# Altium project iF11M.PrjPcb
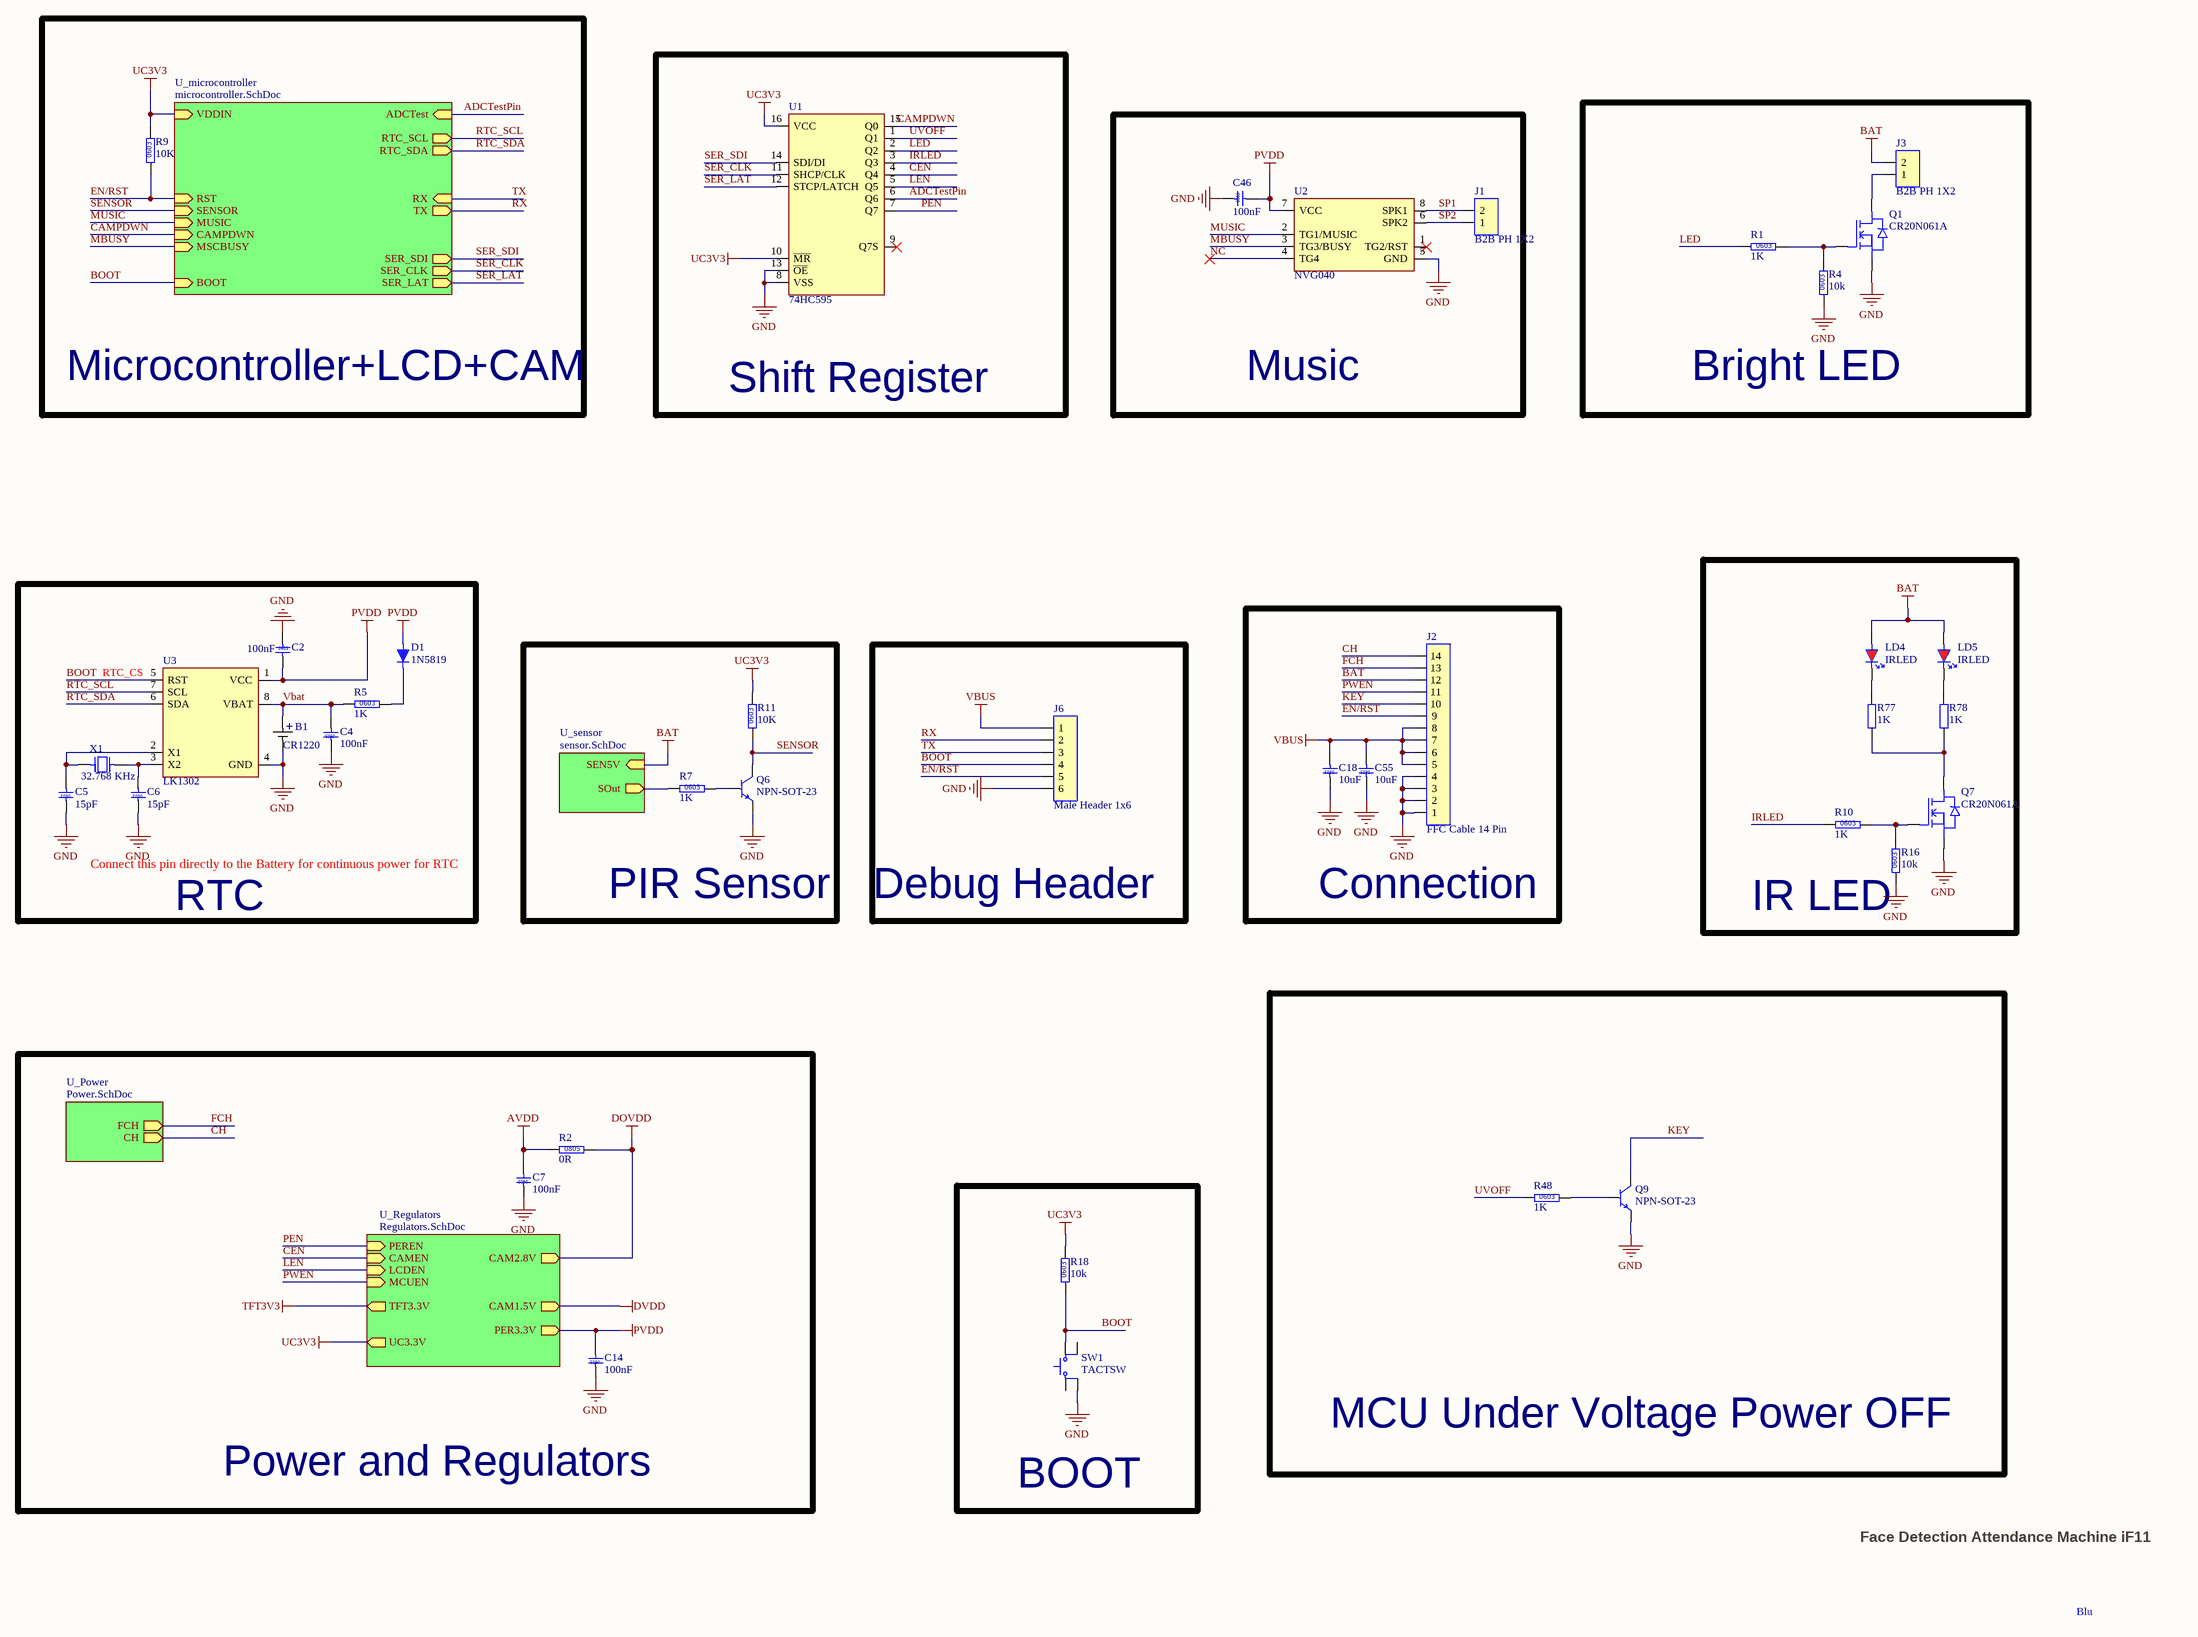
[diagram p0: iF11M.SchDoc]
6 sheets, 148 parts. Net scope: hierarchical (ports join the sheet entries above them; power ports are global).
Board file: iF11M.PcbDoc
Sheets:
  iF11M.SchDoc
    U_sensor = sensor.SchDoc
    U_Regulators = Regulators.SchDoc
    U_Power = Power.SchDoc
      U_Wireless Charging = Wireless Charging.SchDoc
    U_microcontroller = microcontroller.SchDoc

## Sheet iF11M.SchDoc
size C; SheetNumber: 1; SheetTotal: 6

### Parts
B1  CR1220  [CR1220]
C2  100nF  [C0603]
C4  100nF  [C0603]
C5  15pF  [C0603]
C6  15pF  [C0603]
C7  100nF  [C0603]
C14  100nF  [C0603]
C18  10uF  [C0805]
C46  100nF  [C0603]
C55  10uF  [C0805]
D1  1N5819  [SOD-323]
J1  B2B PH 1X2  [B2B-PH-2mm]
J2  FFC Cable 14 Pin  [FPC14P-1.2mm-THT]
J3  B2B PH 1X2  [B2B-PH-2mm]
J6  Male Header 1x6  [MHEADER-1x6]
LD4  IRLED  [LED 5mm RED Bent2]
LD5  IRLED  [LED 5mm RED Bent2 Flipped]
Q1  CR20N061A  [NMOS-SOT23]
Q6  NPN-SOT-23  [SOT23]
Q7  CR20N061A  [NMOS-SOT23]
Q9  NPN-SOT-23  [SOT23]
R1  1K  [R0603-LD]
R2  0R  [R0805-LD]
R4  10k  [R0603-LD]
R5  1K  [R0603-LD]
R7  1K  [R0603-LD]
R9  10K  [R0603-LD]
R10  1K  [R0603-LD]
R11  10K  [R0603-LD]
R16  10k  [R0603-LD]
R18  10k  [R0603-LD]
R48  1K  [R0603-LD]
R77  1K  [R0805]
R78  1K  [R0805]
SW1  TACTSW  [Button 6mm SMD]
U1  74HC595  [SOIC16]
U2  NVG040  [SOP-8]
U3  LK1302  [SOP-8]
X1  32.768 KHz  [RTC Crystal]

### Blocks framed on the sheet
Microcontroller+LCD+CAM: R9
Shift Register: U1
Music: C46 J1 U2
Bright LED: J3 Q1 R1 R4
IR LED: LD4 LD5 Q7 R10 R16 R77 R78
RTC: B1 C2 C4-C6 D1 R5 U3 X1
Connection: C18 C55 J2
PIR Sensor: Q6 R7 R11
Debug Header: J6
MCU Under Voltage Power OFF: Q9 R48
Power and Regulators: C7 C14 R2
BOOT: R18 SW1

### Sub-sheets
U_microcontroller = microcontroller.SchDoc: VDDIN (in), RST (in), RTC_SCL (out), RTC_SDA (out), BOOT (in), SENSOR (in), SER_SDI (out), CAMPDWN (in), SER_CLK (out), SER_LAT (out), RX (in), TX (out), MUSIC (in), MSCBUSY (in), ADCTest (in)
U_Power = Power.SchDoc: CH (out), FCH (out)
U_Regulators = Regulators.SchDoc: CAM2.8V (out), CAM1.5V (out), TFT3.3V (out), UC3.3V (out), CAMEN (in), LCDEN (in), PER3.3V (out), PEREN (in), MCUEN (in)
U_sensor = sensor.SchDoc: SOut (out), SEN5V (in)

### Nets
AVDD: C7.2 R2.1
BAT: J2.12 J3.2 LD4.1(A) LD5.1(A) ; sheet U_sensor/SEN5V
DOVDD: R2.2 ; sheet U_Regulators/CAM2.8V
GND: B1.1 C2.1 C4.1 C5.1 C6.1 C7.1 C14.1 C18.1 C46.1 C55.1 J2.1 J2.2 J2.3 J2.4 J6.6 Q1.3(S) Q6.2(E) Q7.3(S) Q9.2(E) R4.1 R16.1 SW1.2 U1.8(VSS) U1.13(~{OE}) U2.5(GND) U3.4(GND)
PVDD: C2.2 C14.2 C46.2 D1.1(A) U2.7(VCC) U3.1(VCC) ; sheet U_Regulators/PER3.3V
UC3V3: R9.2 R11.2 R18.2 U1.10(~{MR}) U1.16(VCC) ; sheet U_Regulators/UC3.3V, sheet U_microcontroller/VDDIN
VBUS: C18.2 C55.2 J2.5 J2.6 J2.7 J2.8 J6.1
ADCTestPin: U1.6(Q6) ; sheet U_microcontroller/ADCTest
BOOT: J6.4 R18.1 SW1.4 U3.5(RST) ; sheet U_microcontroller/BOOT
CAMPDWN: U1.15(Q0) ; sheet U_microcontroller/CAMPDWN
CEN: U1.4(Q4) ; sheet U_Regulators/CAMEN
CH: J2.14 ; sheet U_Power/CH
DO: R7.1 ; sheet U_sensor/SOut
EN/RST: J2.9 J6.5 R9.1 ; sheet U_microcontroller/RST
FCH: J2.13 ; sheet U_Power/FCH
IRLED: R10.1 U1.3(Q3)
KEY: J2.10 Q9.3(C)
LED: R1.1 U1.2(Q2)
LEN: U1.5(Q5) ; sheet U_Regulators/LCDEN
MBUSY: U2.3(TG3/BUSY) ; sheet U_microcontroller/MSCBUSY
MUSIC: U2.2(TG1/MUSIC) ; sheet U_microcontroller/MUSIC
NC: U2.4(TG4)
PEN: U1.7(Q7) ; sheet U_Regulators/PEREN
PWEN: J2.11 ; sheet U_Regulators/MCUEN
RTC_SCL: U3.7(SCL) ; sheet U_microcontroller/RTC_SCL
RTC_SDA: U3.6(SDA) ; sheet U_microcontroller/RTC_SDA
RX: J6.2 ; sheet U_microcontroller/TX
SENSOR: Q6.3(C) R11.1 ; sheet U_microcontroller/SENSOR
SER_CLK: U1.11(SHCP/CLK) ; sheet U_microcontroller/SER_CLK
SER_LAT: U1.12(STCP/LATCH) ; sheet U_microcontroller/SER_LAT
SER_SDI: U1.14(SDI/DI) ; sheet U_microcontroller/SER_SDI
SP1: J1.2 U2.8(SPK1)
SP2: J1.1 U2.6(SPK2)
TX: J6.3 ; sheet U_microcontroller/RX
UVOFF: R48.1 U1.1(Q1)
Vbat: B1.2 C4.2 R5.1 U3.8(VBAT)
NetC5_2: C5.2 U3.2(X1) X1.2
NetC6_2: C6.2 U3.3(X2) X1.1
NetD1_2: D1.2(K) R5.2
NetJ3_1: J3.1 Q1.2(D)
NetLD4_2: LD4.2(K) R77.2
NetLD5_2: LD5.2(K) R78.2
NetQ1_1: Q1.1(G) R1.2 R4.2
NetQ6_1: Q6.1(B) R7.2
NetQ7_1: Q7.1(G) R10.2 R16.2
NetQ7_2: Q7.2(D) R77.1 R78.1
NetQ9_1: Q9.1(B) R48.2

Not connected (* = marked no-connect by the designer): SW1 1 3; U1 9(Q7S)*; U2 1(TG2/RST)*

### Notes on the sheet
- (near U3) RTC_CS
- Connect this pin directly to the Battery for continuous power for RTC
- Face Detection Attendance Machine iF11
- Blu
- (in symbol C 0603 10pF 25V) 0603
- (in symbol C 0603 100nF 50V) 0603
- (in symbol C 0805 10uF 25V) 0805
- (in symbol CR1220) +
- (in symbol R 0603 1K) 0603
- (in symbol R 0603 10k) 0603
- (in symbol R 0603 10K) 0603
- (in symbol R 0805 0R) 0805

### Library data of the parts
C2 C4 C7 C14 C46 = C 0603 100nF 50V: 10% 50V; Part No: W-T-CA-X703N100K50VNT; Manufacturer: FENGHUA; Material Name: 贴片电容0603 100NF/50V 10%; Product Code: WP0002721; Supplier: 南京南山半导体有限公司
C5 C6 = C 0603 10pF 25V: 5% 25V; Part No: W-T-CA-CG03P010J25VNT; Material Name: 贴片电容0603 10PF/25V 5%; Product Code: WP0002897; Supplier: 南京南山半导体有限公司; Manufacturer: *
C18 C55 = C 0805 10uF 25V: 10% 25V; Part No: WP0005368; Material Name: 贴片电容0805 10UF/25V 10%; Product Code: WP0005368; Supplier: 深圳市四叶电子有限公司; Manufacturer: *
D1 = IN4148
J1 J3 = B2B-PH-2MM: 2 Pin B2B Connector
J2 = FFC14P
J6 = MHeader-1x6: 6 Pin Male Header
Q1 Q7 = MOSFET-N-Channel: Part No: *; Product Code: *; Suppliers: *; Manufacturer: *
R1 R4 R5 R7 R10 R16 R18 = R 0603 10k: 5%; Part No: W-T-RE-RS03K103JT; Manufacturer: 热敏D541V11增加1颗用量; Material Name: 贴片电阻0603 10K 5%; Product Code: WP0002708; Supplier: 南京南山半导体有限公司
R2 = R 0805 0R: 1%; Part No: W-T-RE-RS05K0R0JT; Material Name: 贴片电阻0805 0Ω 1%; Product Code: WP0003559; Supplier: 深圳市四叶电子有限公司; Manufacturer: *
R9 R11 = R 0603 10K: 5%; Part No: W-T-RE-RS03K103JT; Manufacturer: 热敏D541V11增加1颗用量; Material Name: 贴片电阻0603 10K 5%; Product Code: WP0002708; Supplier: 南京南山半导体有限公司
R48 = R 0603 1K: 5%; Part No: W-T-RE-RS03K102JT; Manufacturer: LAGEO; Material Name: 贴片电阻0603 1K  5%; Product Code: WP0002703; Supplier: 南京南山半导体有限公司
R77 R78 = Resistor: Part No: *; Product Code: *; Suppliers: 南京南山半导体有限公司; Manufacturer: *
SW1 = Tactile-smd plastic: 2 pin tactile switch round
U1 = 74595: 8bit Serial/Parallel Shift Register
U3 = LK1302: Trickle-Charge Timekeeping Chip
X1 = Crystal_RTC: RTC Crystal
LD4 LD5 = IRLED: Part No: *; Product Code: *; Suppliers: *; Manufacturer: *

## Sheet sensor.SchDoc
size A; SheetNumber: 3; SheetTotal: 6
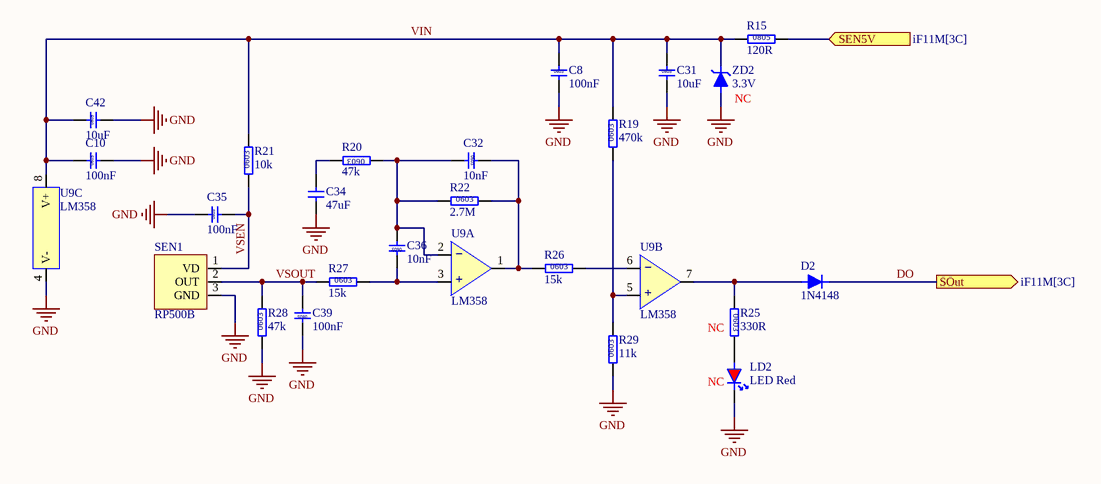
[diagram p1: sensor.SchDoc]

### Parts
C8  100nF  [C0603]
C10  100nF  [C0603]
C31  10uF  [C0805]
C32  10nF  [C0603]
C34  47uF  [C0603]
C35  100nF  [C0805]
C36  10nF  [C0603]
C39  100nF  [C0805]
C42  10uF  [C0805]
D2  1N4148  [SOD-323]
LD2  LED Red  [LED-0603-RED]
R15  120R  [R0805-LD]
R19  470k  [R0603-LD]
R20  47k  [R0603-LD]
R21  10k  [R0603-LD]
R22  2.7M  [R0603-LD]
R25  330R  [R0603-LD]
R26  15k  [R0603-LD]
R27  15k  [R0603-LD]
R28  47k  [R0603-LD]
R29  11k  [R0603-LD]
SEN1  RP500B  [TO-5-Lbent]
U9  LM358  [LM358-SOIC8]  (parts A,B,C of 3)
ZD2  3.3V  [SOD-323]

### Ports
SEN5V (in, see iF11M[3C]), SOut (out, see iF11M[3C])

### Nets
BAT: R15.2 ; port SEN5V
GND: C8.2 C10.2 C31.2 C34.2 C35.1 C39.1 C42.2 LD2.2(K) R28.1 R29.1 SEN1.3(GND) U9.4(V-) ZD2.1(A)
DO: D2.2(K) ; port SOut
VIN: C8.1 C10.1 C31.1 C42.1 R15.1 R19.2 R21.2 U9.8(V+) ZD2.2(K)
VSEN: C35.2 R21.1 SEN1.1(VD)
VSOUT: C39.2 R27.1 R28.2 SEN1.2(OUT)
NetC32_1: C32.1 R22.2 R26.1 U9.1(O1)
NetC32_2: C32.2 C36.2 R20.1 R22.1 U9.2(-)
NetC34_1: C34.1 R20.2
NetC36_1: C36.1 R27.2 U9.3(+)
NetD2_1: D2.1(A) R25.1 U9.7(O2)
NetLD2_1: LD2.1(A) R25.2
NetR19_1: R19.1 R29.2 U9.5(+)
NetR26_2: R26.2 U9.6(-)

### Notes on the sheet
- (near ZD2) NC
- (near R25) NC
- (near LD2) NC
- (in symbol C 0603 10nF 50V) 0603
- (in symbol C 0603 100nF 50V) 0603
- (in symbol C 0805 10uF 25V) 0805
- (in symbol C 0805 100nF 50V) 0805
- (in symbol LM358, part A) −
- (in symbol LM358, part B) −
- (in symbol R 0603 10k) 0603
- (in symbol R 0603 15k) 0603
- (in symbol R 0603 47k) 0603
- (in symbol R 0603 330R) 0603
- (in symbol R 0805 120R) 0805

### Library data of the parts
C8 C10 = C 0603 100nF 50V: as C2 on sheet iF11M; Supplier: 南京南山半导体有限公司
C31 C42 = C 0805 10uF 25V: as C18 on sheet iF11M; Product Code: WP0005368; Supplier: 深圳市四叶电子有限公司; Manufacturer: *
C32 C36 = C 0603 10nF 50V: 10% 50V; Part No: W-T-CA-X703N10K50VNT; Material Name: 贴片电容0603 10NF/50V 10%; Product Code: WP0003409; Supplier: 南京南山半导体有限公司; Manufacturer: *
C34 = Capacitor: SMD resistor  Package; Part No: *; Product Code: *; Suppliers: 南京南山半导体有限公司; Manufacturer: *
C35 C39 = C 0805 100nF 50V: 10% 50V; Part No: W-T-CA-X705N100K50VNT; Material Name: 贴片电容0805 100NF/50V 10%; Product Code: WP0002825; Supplier: "深圳市硕洋电子科技有限公司; Manufacturer: *
D2 = IN4148: Part No: W-T-DE-1N4148-SOD123; Material Name: 开关二极管/4148-SOD123; Product Code: WP0002828; Supplier: 上海吉锝芯微电子有限公司
R15 = R 0805 120R: 5%; Part No: W-T-RE-RS05K121JT; Material Name: 贴片电阻0805 120Ω 5%; Product Code: WP0003450; Supplier: 南京南山半导体有限公司; Manufacturer: *
R19 R26 R27 = R 0603 15k: 5%; Part No: W-T-RE-RS03K153JT; Manufacturer: 改善传感器，2023/01/08新增; Material Name: 贴片电阻0603 15K 5%; Product Code: WP0002709; Supplier: 南京南山半导体有限公司
R20 R22 R28 = R 0603 47k: 5%; Part No: W-T-RE-RS03K473JT; Material Name: 贴片电阻0603 47K 5%; Product Code: WP0003793; Supplier: 南京南山半导体有限公司
R21 R29 = R 0603 10k: as R1 on sheet iF11M; Supplier: 南京南山半导体有限公司
R25 = R 0603 330R: 5%; Part No: W-T-RE-RS03K331JT; Material Name: 贴片电阻0603 330Ω 5%; Product Code: WP0003776; Supplier: 南京南山半导体有限公司
U9 = LM358: DUAL OPAMP
ZD2 = Zener Diode: Zener Diode 300mW
LD2 = LED Red: Part No: *; Product Code: *; Suppliers: *; Manufacturer: *

## Sheet Regulators.SchDoc
size A; SheetNumber: 2; SheetTotal: 6
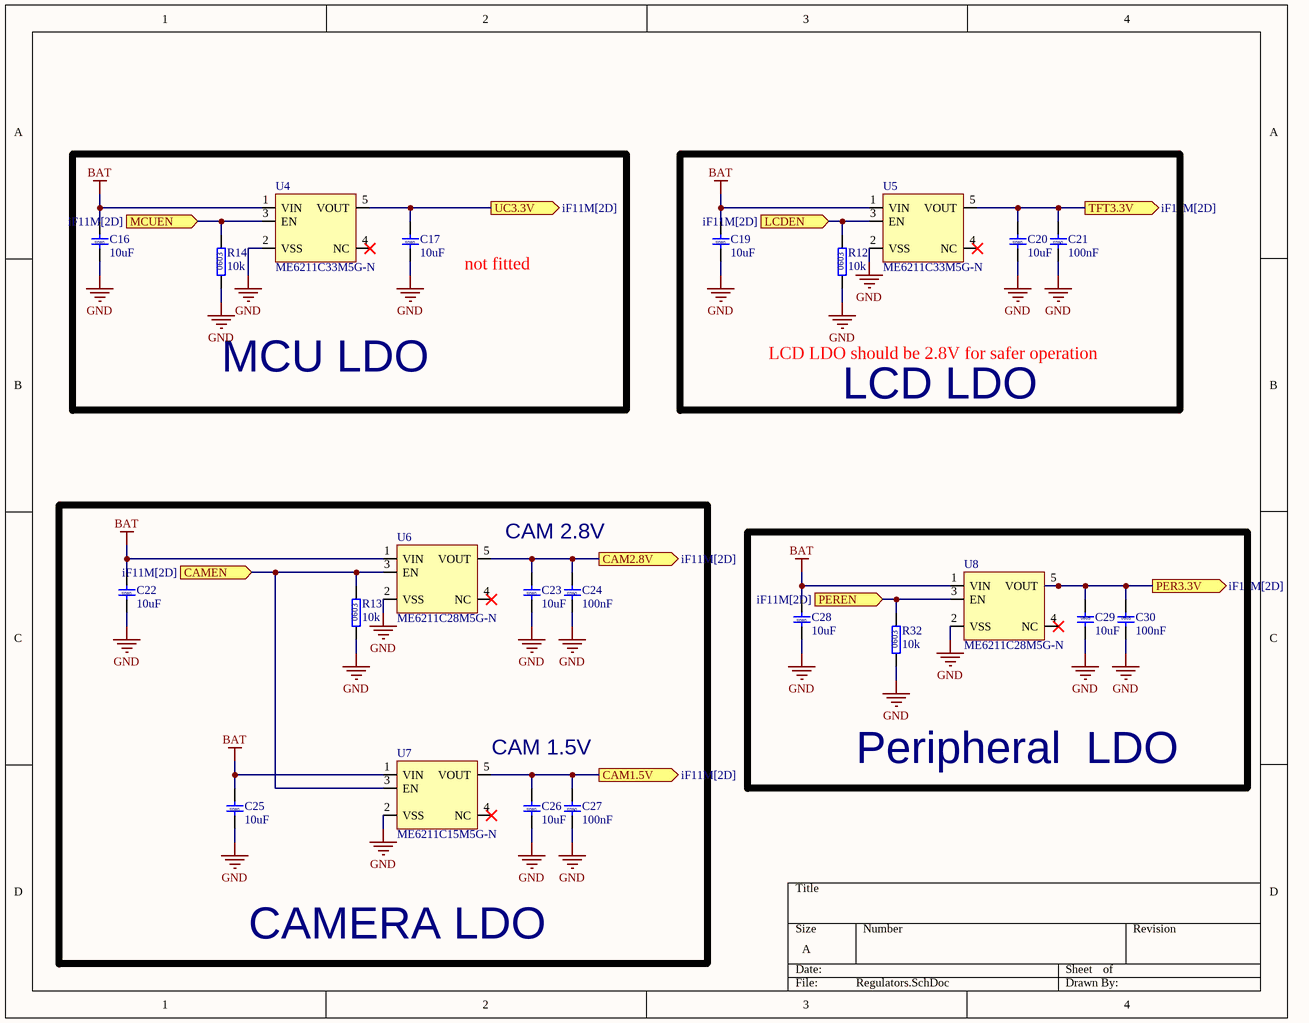
[diagram p2: Regulators.SchDoc]

### Parts
C16  10uF  [C0805]
C17  10uF  [C0805]
C19  10uF  [C0805]
C20  10uF  [C0805]
C21  100nF  [C0603]
C22  10uF  [C0805]
C23  10uF  [C0805]
C24  100nF  [C0603]
C25  10uF  [C0805]
C26  10uF  [C0805]
C27  100nF  [C0603]
C28  10uF  [C0805]
C29  10uF  [C0805]
C30  100nF  [C0603]
R12  10k  [R0603-LD]
R13  10k  [R0603-LD]
R14  10k  [R0603-LD]
R32  10k  [R0603-LD]
U4  ME6211C33M5G-N  [SOT23-5]
U5  ME6211C33M5G-N  [SOT23-5]
U6  ME6211C28M5G-N  [SOT23-5]
U7  ME6211C15M5G-N  [SOT23-5]
U8  ME6211C28M5G-N  [SOT23-5]

### Blocks framed on the sheet
MCU LDO: C16 C17 R14 U4
LCD LDO: C19-C21 R12 U5
CAMERA LDO: C22-C27 R13 U6 U7
Peripheral  LDO: C28-C30 R32 U8

### Ports
CAM1.5V (out, see iF11M[2D]), CAM2.8V (out, see iF11M[2D]), CAMEN (in, see iF11M[2D]), LCDEN (in, see iF11M[2D]), MCUEN (in, see iF11M[2D]), PER3.3V (out, see iF11M[2D]), PEREN (in, see iF11M[2D]), TFT3.3V (out, see iF11M[2D]), UC3.3V (out, see iF11M[2D])

### Nets
BAT: C16.2 C19.2 C22.2 C25.2 C28.2 U4.1(VIN) U5.1(VIN) U6.1(VIN) U7.1(VIN) U8.1(VIN)
DOVDD: C23.2 C24.2 U6.5(VOUT) ; port CAM2.8V
DVDD: C26.2 C27.2 U7.5(VOUT) ; port CAM1.5V
GND: C16.1 C17.1 C19.1 C20.1 C21.1 C22.1 C23.1 C24.1 C25.1 C26.1 C27.1 C28.1 C29.2 C30.2 R12.1 R13.1 R14.1 R32.1 U4.2(VSS) U5.2(VSS) U6.2(VSS) U7.2(VSS) U8.2(VSS)
PVDD: C29.1 C30.1 U8.5(VOUT) ; port PER3.3V
TFT3V3: C20.2 C21.2 U5.5(VOUT) ; port TFT3.3V
UC3V3: C17.2 U4.5(VOUT) ; port UC3.3V
CEN: R13.2 U6.3(EN) U7.3(EN) ; port CAMEN
LEN: R12.2 U5.3(EN) ; port LCDEN
PEN: R32.2 U8.3(EN) ; port PEREN
PWEN: R14.2 U4.3(EN) ; port MCUEN

Not connected (* = marked no-connect by the designer): U4 4(NC)*; U5 4(NC)*; U6 4(NC)*; U7 4(NC)*; U8 4(NC)*

### Notes on the sheet
- not fitted
- LCD LDO should be 2.8V for safer operation
- CAM 2.8V
- (near U7) CAM 1.5V
- (in symbol C 0603 100nF 50V) 0603
- (in symbol C 0805 10uF 25V) 0805
- (in symbol R 0603 10k) 0603

### Library data of the parts
C16 C17 C19 C20 C22 C23 C25 C26 C28 C29 = C 0805 10uF 25V: as C18 on sheet iF11M; Product Code: WP0005368; Supplier: 深圳市四叶电子有限公司; Manufacturer: *
C21 C24 C27 C30 = C 0603 100nF 50V: as C2 on sheet iF11M; Supplier: 南京南山半导体有限公司
R12-R14 R32 = R 0603 10k: as R1 on sheet iF11M; Supplier: 南京南山半导体有限公司
U4-U8 = ME6211C28M5G

## Sheet Power.SchDoc
size A; SheetNumber: 4; SheetTotal: 6
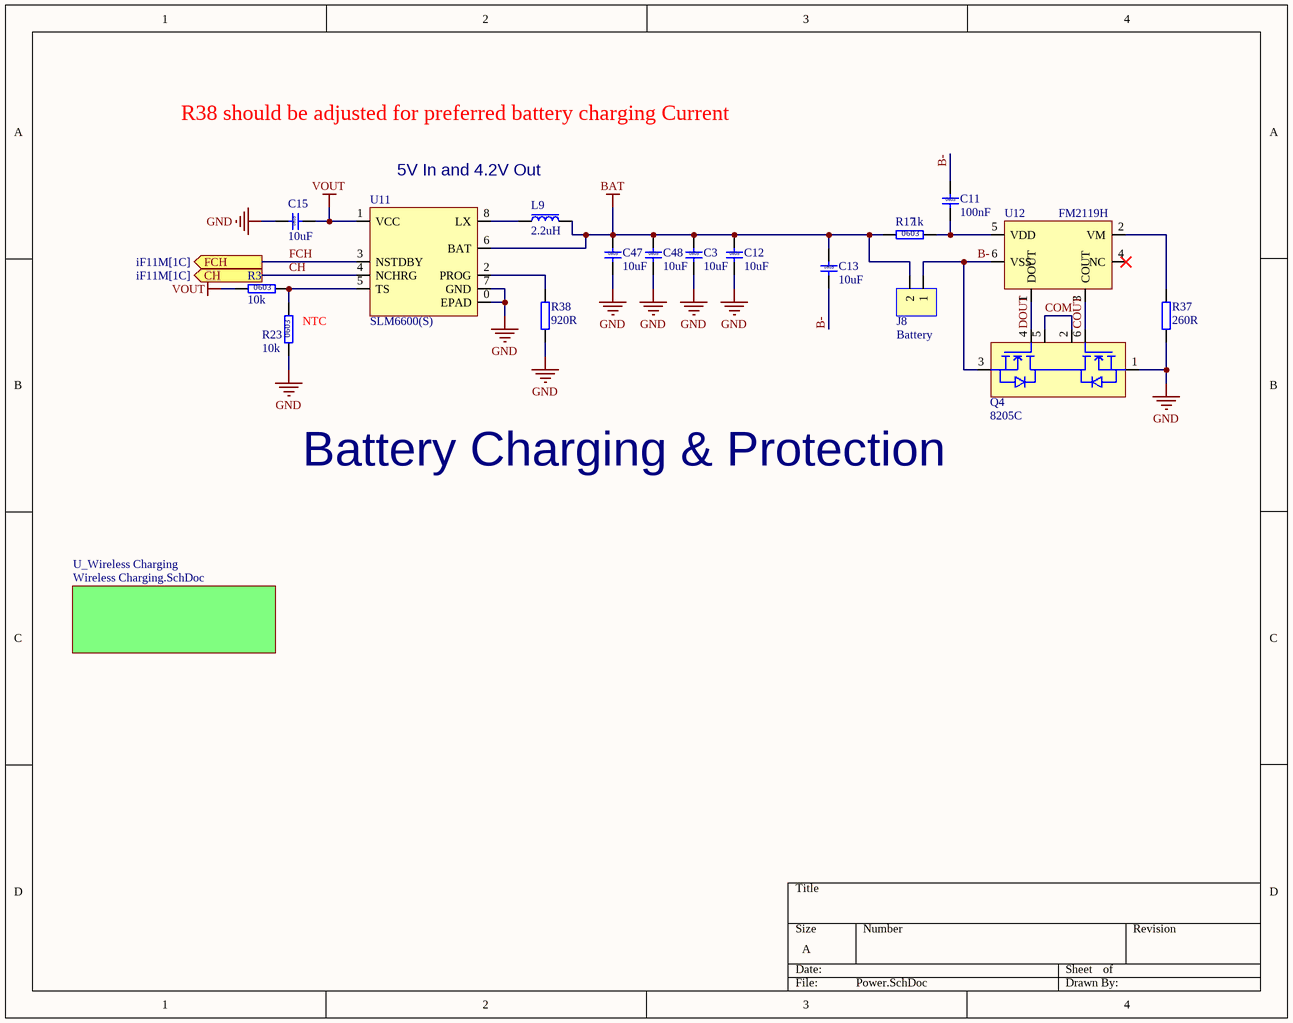
[diagram p3: Power.SchDoc]

### Parts
C3  10uF  [C0805]
C11  100nF  [C0603]
C12  10uF  [C0805]
C13  10uF  [C0805]
C15  10uF  [C0805]
C47  10uF  [C0805]
C48  10uF  [C0805]
J8  Battery  [B2B-PH-2mm]
L9  2.2uH  [CD54]
Q4  8205C  [SOT23-6]
R3  10k  [R0603-LD]
R17  1k  [R0603-LD]
R23  10k  [R0603-LD]
R37  260R  [R0603]
R38  920R  [R0603]
U11  SLM6600(S)  [SOP-8 - EPAD]
U12  FM2119H  [SOT23-6]

### Sub-sheets
U_Wireless Charging = Wireless Charging.SchDoc: no entries

### Ports
CH (out, see iF11M[1C]), FCH (out, see iF11M[1C])

### Nets
BAT: C3.1 C12.1 C13.1 C47.1 C48.1 J8.2 L9.2 R17.1 U11.6(BAT)
GND: C3.2 C12.2 C15.1 C47.2 C48.2 Q4.1(S1) R23.1 R37.1 R38.1 U11.0(EPAD) U11.7(GND)
VOUT: C15.2 R3.1 U11.1(VCC)
B-: C11.1 C13.2 J8.1 Q4.3(S2) U12.6(VSS)
CH: U11.4(NCHRG) ; port CH
COM: Q4.2(D1) Q4.5(D2)
COUT: Q4.6(G1) U12.3(COUT)
DOUT: Q4.4(G2) U12.1(DOUT)
FCH: U11.3(NSTDBY) ; port FCH
NetC11_2: C11.2 R17.2 U12.5(VDD)
NetL9_1: L9.1 U11.8(LX)
NetR3_2: R3.2 R23.2 U11.5(TS)
NetR37_2: R37.2 U12.2(VM)
NetR38_2: R38.2 U11.2(PROG)

Not connected (* = marked no-connect by the designer): U12 4(NC)*

### Notes on the sheet
- R38 should be adjusted for preferred battery charging Current
- 5V In and 4.2V Out
- (near R23) NTC
- Battery Charging & Protection
- (in symbol C 0603 100nF 50V) 0603
- (in symbol C 0805 10uF 25V) 0805
- (in symbol C 0805 22uF 16V) 0805
- (in symbol R 0603 1k) 0603
- (in symbol R 0603 10k) 0603

### Library data of the parts
C3 C12 C13 C47 C48 = C 0805 22uF 16V: 10% 16V; Part No: WP0005367; Material Name: 贴片电容0805 22UF/16V 10%; Product Code: WP0005367; Supplier: 深圳市四叶电子有限公司; Manufacturer: *
C11 = C 0603 100nF 50V: as C2 on sheet iF11M; Supplier: 南京南山半导体有限公司
C15 = C 0805 10uF 25V: as C18 on sheet iF11M; Product Code: WP0005368; Supplier: 深圳市四叶电子有限公司; Manufacturer: *
J8 = B2B-PH-2MM: B2B PH 1X2 2 Pin B2B Connector
L9 = CD54: SMD Inductor 2.2 uH CD54
Q4 = JST8205S: 20V N-channel enhancement MOS field effect transistor
R3 R23 = R 0603 10k: as R1 on sheet iF11M; Supplier: 南京南山半导体有限公司
R17 = R 0603 1k: 5%; Part No: W-T-RE-RS03K102JT; Manufacturer: LAGEO; Material Name: 贴片电阻0603 1K  5%; Product Code: WP0002703; Supplier: 南京南山半导体有限公司
R37 R38 = Resistor: Part No: *; Product Code: *; Suppliers: 南京南山半导体有限公司; Manufacturer: *

## Sheet Wireless Charging.SchDoc
size A; SheetNumber: 5; SheetTotal: 6
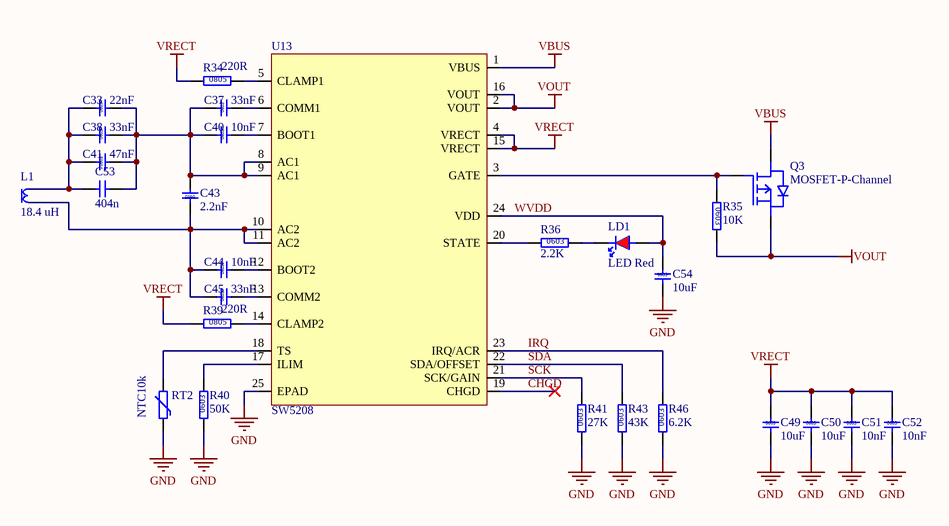
[diagram p4: Wireless Charging.SchDoc]

### Parts
C33  22nF  [C0603]
C37  33nF  [C0603]
C38  33nF  [C0603]
C40  10nF  [C0603]
C41  47nF  [C0603]
C43  2.2nF  [C0603]
C44  10nF  [C0603]
C45  33nF  [C0603]
C49  10uF  [C0805]
C50  10uF  [C0805]
C51  10nF  [C0603]
C52  10nF  [C0603]
C53  404n  [CBB Capacitor-7.1mm-WO3D]
C54  10uF  [C0805]
L1  18.4 uH  [SMD PAD 1x2]
LD1  LED Red  [LED-0603-RED]
Q3  MOSFET-P-Channel  [PMOS-SOT23]
R34  220R  [R0805-LD]
R35  10K  [R0603-LD]
R36  2.2K  [R0603-LD]
R39  220R  [R0805-LD]
R40  50K  [R0603-LD]
R41  27K  [R0603-LD]
R43  43K  [R0603-LD]
R46  6.2K  [R0603-LD]
RT2  NTC10k  [RT0603]
U13  SW5208  [QFN-24-4x4-0.5P]

### Nets
GND: C49.2 C50.2 C51.2 C52.2 C54.2 R40.1 R41.1 R43.1 R46.1 RT2.1 U13.25(EPAD)
VBUS: Q3.2(D) U13.1(VBUS)
VOUT: Q3.3(S) R35.2 U13.2(VOUT) U13.16(VOUT)
VRECT: C49.1 C50.1 C51.1 C52.1 R34.1 R39.1 U13.4(VRECT) U13.15(VRECT)
CHGD: U13.19(CHGD)
IRQ: R46.2 U13.23(IRQ/ACR)
SCK: R41.2 U13.21(SCK/GAIN)
SDA: R43.2 U13.22(SDA/OFFSET)
WVDD: C54.1 LD1.1(A) U13.24(VDD)
NetC33_1: C33.1 C38.1 C41.1 C53.2 L1.2
NetC33_2: C33.2 C37.1 C38.2 C40.1 C41.2 C43.2 C53.1 U13.8(AC1) U13.9(AC1)
NetC37_2: C37.2 U13.6(COMM1)
NetC40_2: C40.2 U13.7(BOOT1)
NetC43_1: C43.1 C44.1 C45.1 L1.1 U13.10(AC2) U13.11(AC2)
NetC44_2: C44.2 U13.12(BOOT2)
NetC45_2: C45.2 U13.13(COMM2)
NetLD1_2: LD1.2(K) R36.2
NetQ3_1: Q3.1(G) R35.1 U13.3(GATE)
NetR34_2: R34.2 U13.5(CLAMP1)
NetR36_1: R36.1 U13.20(STATE)
NetR39_2: R39.2 U13.14(CLAMP2)
NetR40_2: R40.2 U13.17(ILIM)
NetRT2_2: RT2.2 U13.18(TS)

### Notes on the sheet
- (in symbol C 0603 2.2nF 50V) 0603
- (in symbol C 0603 10nF 50V) 0603
- (in symbol C 0805 10uF 25V) 0805
- (in symbol R 0603 2.7K) 0603
- (in symbol R 0603 2K) 0603
- (in symbol R 0603 10K) 0603
- (in symbol R 0603 51K) 0603
- (in symbol R 0805 120R) 0805

### Library data of the parts
C33 C37 C38 C40 C41 C44 C45 C51 C52 = C 0603 10nF 50V: as C32 on sheet sensor; Supplier: 南京南山半导体有限公司; Manufacturer: *
C43 = C 0603 2.2nF 50V: 10% 50V; Part No: WP0005364; Material Name: 贴片电容0603 2.2nF/50V 10%; Product Code: WP0005364; Supplier: 南京南山半导体有限公司; Manufacturer: *
C49 C50 C54 = C 0805 10uF 25V: as C18 on sheet iF11M; Product Code: WP0005368; Supplier: 深圳市四叶电子有限公司; Manufacturer: *
C53 = Capacitor: CBB Capacitor 404n 100V; Part No: *; Product Code: *; Suppliers: 南京南山半导体有限公司; Manufacturer: *
L1 = Wcoil: SMD Inductor
R34 R39 = R 0805 120R: as R15 on sheet sensor; Supplier: 南京南山半导体有限公司; Manufacturer: *
R35 = R 0603 10K: as R9 on sheet iF11M; Supplier: 南京南山半导体有限公司
R36 = R 0603 2.7K: 5%; Part No: W-T-RE-RS03K272JT; Material Name: 贴片电阻0603 2.7K 5%; Product Code: WP0002877; Supplier: 南京南山半导体有限公司
R40 = R 0603 51K: 1%; Part No: WP0005360; Material Name: 贴片电阻0603 51K 1%; Product Code: WP0005360; Supplier: 南京南山半导体有限公司; Manufacturer: *
R41 R43 R46 = R 0603 2K: 1%; Part No: W-T-RE-RS03K202FT; Material Name: 贴片电阻0603 2K 1%; Product Code: WP0002768; Supplier: 南京南山半导体有限公司; Manufacturer: *
RT2 = Thermistor
LD1 = LED Red: Part No: *; Product Code: *; Suppliers: *; Manufacturer: *
Q3 = MOSFET-P-Channel: Part No: *; Product Code: *; Suppliers: *; Manufacturer: *

## Sheet microcontroller.SchDoc
size B; SheetNumber: 6; SheetTotal: 6
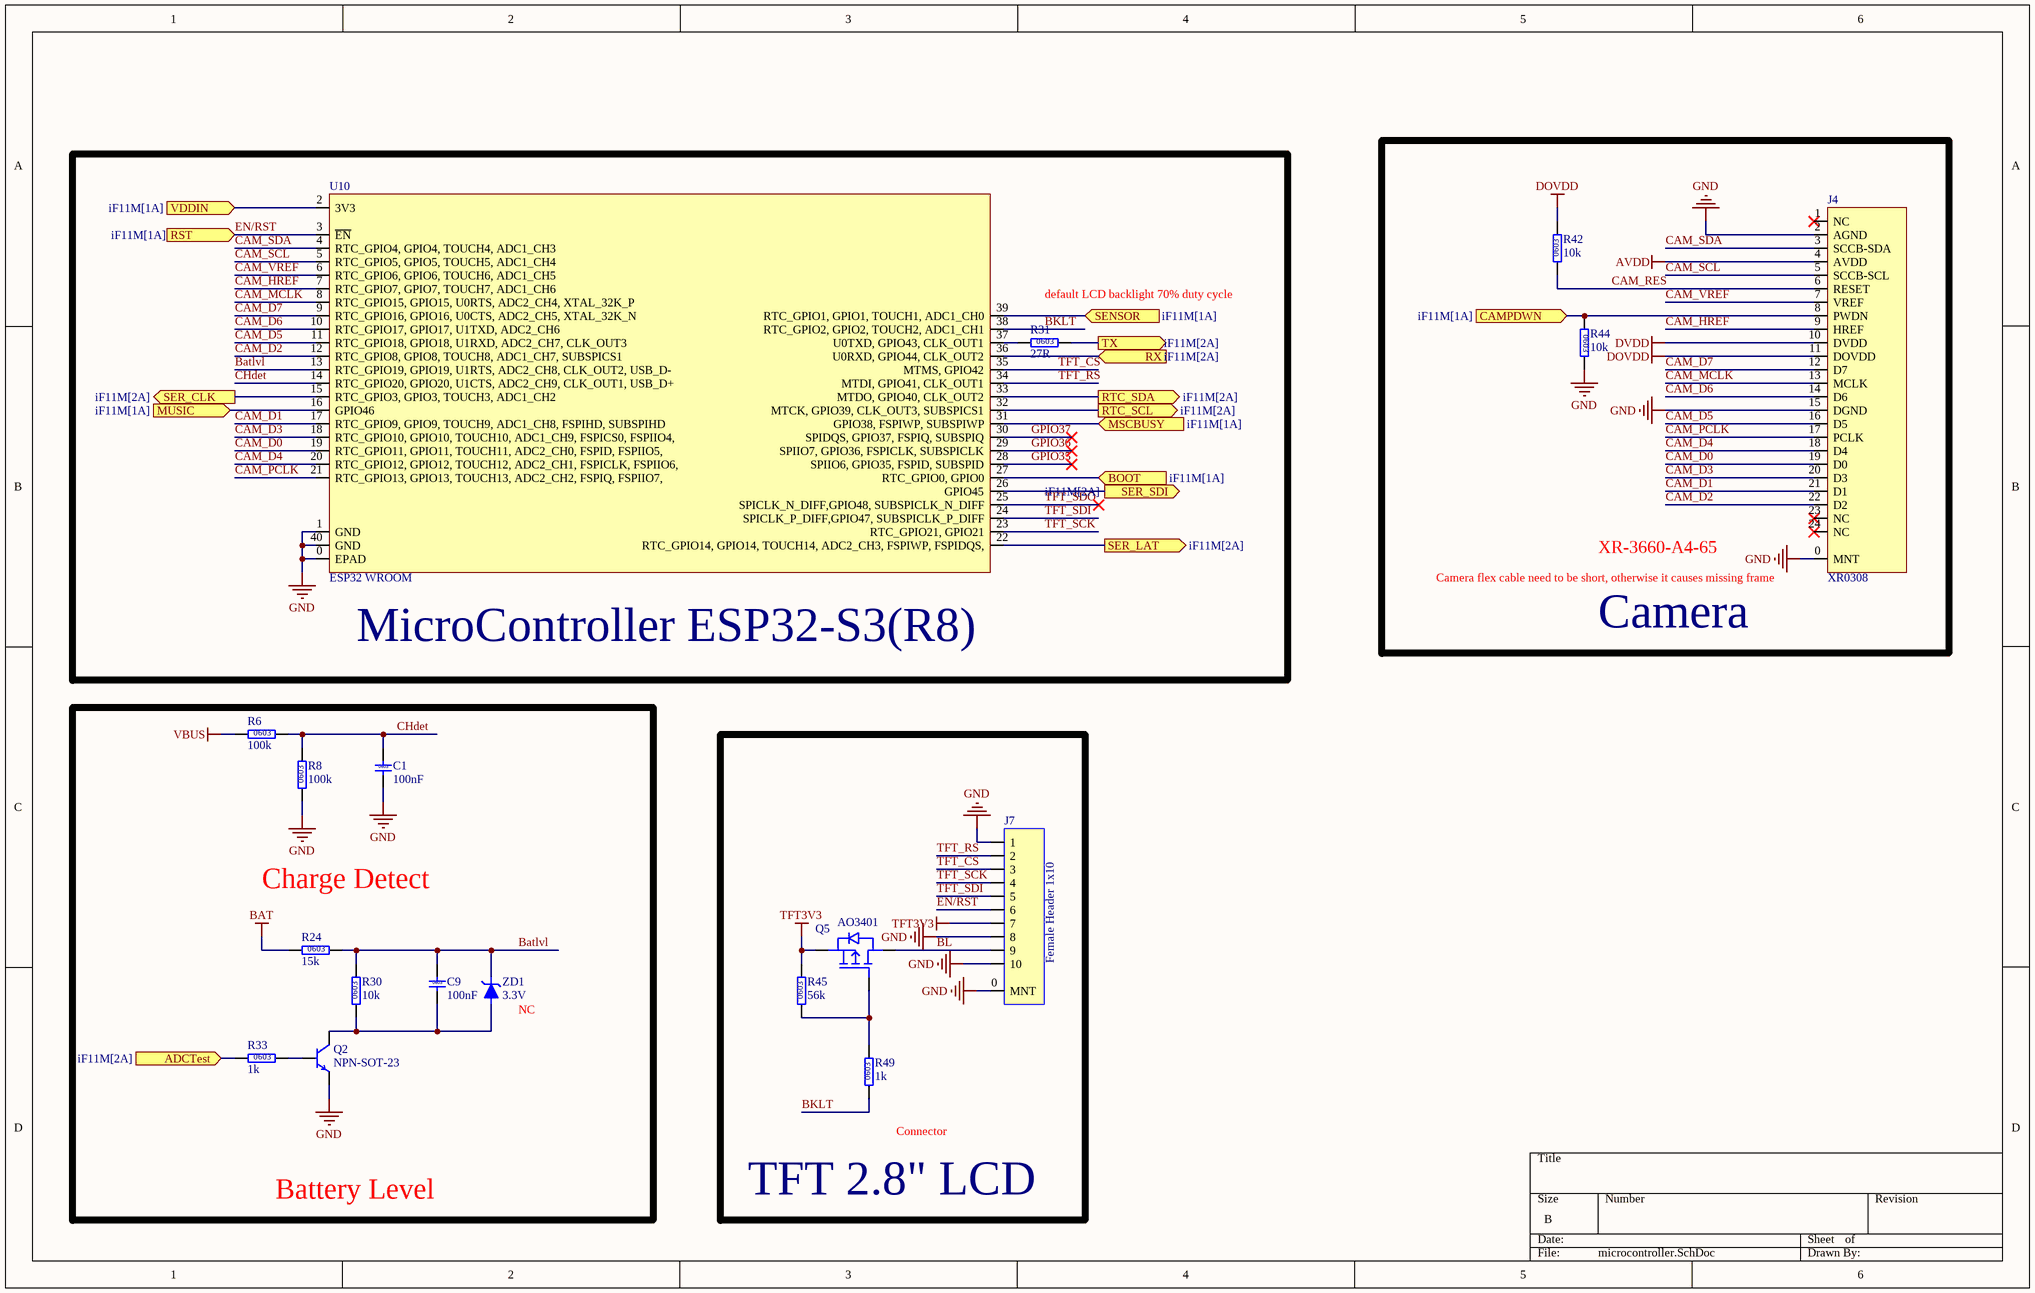
[diagram p5: microcontroller.SchDoc]

### Parts
C1  100nF  [C0603]
C9  100nF  [C0603]
J4  XR0308  [FPC24-0.5P-TOP]
J7  Female Header 1x10  [FPC10-1mm-SMT  BOTTOM]
Q2  NPN-SOT-23  [SOT23]
Q5  AO3401  [PMOS-SOT23]
R6  100k  [R0603-LD]
R8  100k  [R0603-LD]
R24  15k  [R0603-LD]
R30  10k  [R0603-LD]
R31  27R  [R0603-LD]
R33  1k  [R0603-LD]
R42  10k  [R0603-LD]
R44  10k  [R0603-LD]
R45  56k  [R0603-LD]
R49  1k  [R0603-LD]
U10  ESP32 WROOM  [ESP32-S3-WROOM-1]
ZD1  3.3V  [SOD-323]

### Blocks framed on the sheet
MicroController ESP32-S3(R8): R31 U10
Camera: J4 R42 R44
TFT 2.8" LCD: J7 Q5 R45 R49

### Ports
ADCTest (in, see iF11M[2A]), BOOT (in, see iF11M[1A]), CAMPDWN (in, see iF11M[1A]), MSCBUSY (in, see iF11M[1A]), MUSIC (in, see iF11M[1A]), RST (in, see iF11M[1A]), RTC_SCL (out, see iF11M[2A]), RTC_SDA (out, see iF11M[2A]), RX (in, see iF11M[2A]), SENSOR (in, see iF11M[1A]), SER_CLK (out, see iF11M[2A]), SER_LAT (out, see iF11M[2A]), SER_SDI (out, see iF11M[2A]), TX (out, see iF11M[2A]), VDDIN (in, see iF11M[1A])

### Nets
AVDD: J4.4(AVDD)
BAT: R24.1
DOVDD: J4.11(DOVDD) R42.2
DVDD: J4.10(DVDD)
GND: C1.2 J4.0(MNT) J4.2(AGND) J4.15(DGND) J7.0(MNT) J7.1 J7.8 J7.10 Q2.2(E) R8.1 R44.2 U10.0(EPAD) U10.1(GND) U10.40(GND)
TFT3V3: J7.7 Q5.3(S) R45.2
UC3V3: U10.2(3V3) ; port VDDIN
VBUS: R6.1
ADCTestPin: R33.1 ; port ADCTest
Batlvl: C9.1 R24.2 R30.2 U10.13(RTC_GPIO19,_GPIO19,_U1RTS,_ADC2_CH8,_CLK_OUT2,_USB_D-) ZD1.2(K)
BKLT: R49.1 U10.38(RTC_GPIO2,_GPIO2,_TOUCH2,_ADC1_CH1)
BL: J7.9 Q5.2(D)
BOOT: U10.27(RTC_GPIO0,_GPIO0) ; port BOOT
CAM_D0: J4.19(D0) U10.19(RTC_GPIO11,_GPIO11,_TOUCH11,_ADC2_CH0,_FSPID,_FSPIIO5,)
CAM_D1: J4.21(D1) U10.17(RTC_GPIO9,_GPIO9,_TOUCH9,_ADC1_CH8,_FSPIHD,_SUBSPIHD)
CAM_D2: J4.22(D2) U10.12(RTC_GPIO8,_GPIO8,_TOUCH8,_ADC1_CH7,_SUBSPICS1)
CAM_D3: J4.20(D3) U10.18(RTC_GPIO10,_GPIO10,_TOUCH10,_ADC1_CH9,_FSPICS0,_FSPIIO4,)
CAM_D4: J4.18(D4) U10.20(RTC_GPIO12,_GPIO12,_TOUCH12,_ADC2_CH1,_FSPICLK,_FSPIIO6,)
CAM_D5: J4.16(D5) U10.11(RTC_GPIO18,_GPIO18,_U1RXD,_ADC2_CH7,_CLK_OUT3)
CAM_D6: J4.14(D6) U10.10(RTC_GPIO17,_GPIO17,_U1TXD,_ADC2_CH6)
CAM_D7: J4.12(D7) U10.9(RTC_GPIO16,_GPIO16,_U0CTS,_ADC2_CH5,_XTAL_32K_N)
CAM_HREF: J4.9(HREF) U10.7(RTC_GPIO7,_GPIO7,_TOUCH7,_ADC1_CH6)
CAM_MCLK: J4.13(MCLK) U10.8(RTC_GPIO15,_GPIO15,_U0RTS,_ADC2_CH4,_XTAL_32K_P)
CAM_PCLK: J4.17(PCLK) U10.21(RTC_GPIO13,_GPIO13,_TOUCH13,_ADC2_CH2,_FSPIQ,_FSPIIO7,)
CAM_RES: J4.6(RESET) R42.1
CAM_SCL: J4.5(SCCB-SCL) U10.5(RTC_GPIO5,_GPIO5,_TOUCH5,_ADC1_CH4)
CAM_SDA: J4.3(SCCB-SDA) U10.4(RTC_GPIO4,_GPIO4,_TOUCH4,_ADC1_CH3)
CAM_VREF: J4.7(VREF) U10.6(RTC_GPIO6,_GPIO6,_TOUCH6,_ADC1_CH5)
CAMPDWN: J4.8(PWDN) R44.1 ; port CAMPDWN
CHdet: C1.1 R6.2 R8.2 U10.14(RTC_GPIO20,_GPIO20,_U1CTS,_ADC2_CH9,_CLK_OUT1,_USB_D+)
EN/RST: J7.6 U10.3(~{EN}) ; port RST
GPIO35: U10.28(SPIIO6,_GPIO35,_FSPID,_SUBSPID)
GPIO36: U10.29(SPIIO7,_GPIO36,_FSPICLK,_SUBSPICLK)
GPIO37: U10.30(SPIDQS,_GPIO37,_FSPIQ,_SUBSPIQ)
MBUSY: U10.31(GPIO38,_FSPIWP,_SUBSPIWP) ; port MSCBUSY
MUSIC: U10.16(GPIO46) ; port MUSIC
RTC_SCL: U10.32(MTCK,_GPIO39,_CLK_OUT3,_SUBSPICS1) ; port RTC_SCL
RTC_SDA: U10.33(MTDO,_GPIO40,_CLK_OUT2) ; port RTC_SDA
RX: R31.2 ; port TX
SENSOR: U10.39(RTC_GPIO1,_GPIO1,_TOUCH1,_ADC1_CH0) ; port SENSOR
SER_CLK: U10.15(RTC_GPIO3,_GPIO3,_TOUCH3,_ADC1_CH2) ; port SER_CLK
SER_LAT: U10.22(RTC_GPIO14,_GPIO14,_TOUCH14,_ADC2_CH3,_FSPIWP,_FSPIDQS,) ; port SER_LAT
SER_SDI: U10.26(GPIO45) ; port SER_SDI
TFT_CS: J7.3 U10.35(MTMS,_GPIO42)
TFT_RS: J7.2 U10.34(MTDI,_GPIO41,_CLK_OUT1)
TFT_SCK: J7.4 U10.23(RTC_GPIO21,_GPIO21)
TFT_SDI: J7.5 U10.24(SPICLK_P_DIFF,GPIO47,_SUBSPICLK_P_DIFF)
TFT_SDO: U10.25(SPICLK_N_DIFF,GPIO48,_SUBSPICLK_N_DIFF)
TX: U10.36(U0RXD,_GPIO44,_CLK_OUT2) ; port RX
NetC9_2: C9.2 Q2.3(C) R30.1 ZD1.1(A)
NetQ2_1: Q2.1(B) R33.2
NetQ5_1: Q5.1(G) R45.1 R49.2
NetR31_1: R31.1 U10.37(U0TXD,_GPIO43,_CLK_OUT1)

Not connected (* = marked no-connect by the designer): J4 1(NC)* 23(NC)* 24(NC)*

### Notes on the sheet
- default LCD backlight 70% duty cycle
- XR-3660-A4-65
- (near J4) Camera flex cable need to be short, otherwise it causes missing frame
- Charge Detect
- (near ZD1) NC
- (near R49) Connector
- Battery Level
- (in symbol C 0603 100nF 50V) 0603
- (in symbol R 0603 1k) 0603
- (in symbol R 0603 10k) 0603
- (in symbol R 0603 27R) 0603
- (in symbol R 0603 56k) 0603
- (in symbol R 0603 100k) 0603

### Library data of the parts
C1 C9 = C 0603 100nF 50V: as C2 on sheet iF11M; Supplier: 南京南山半导体有限公司
J4 = XR0308-TOP
J7 = FPC10P-1mm-BOT: 10 Pin FPC BOTTOM Contact
Q5 = MOSFET-P-Channel: Part No: *; Product Code: *; Suppliers: *; Manufacturer: *
R6 R8 R24 R30 = R 0603 100k: 5%; Part No: W-T-RE-RS03K104JT; Manufacturer: LAGEO; Material Name: 贴片电阻0603 100K 5%; Product Code: WP0002713; Supplier: 南京南山半导体有限公司
R31 = R 0603 27R: 5%; Part No: W-T-RE-RS03K270JT; Manufacturer: LAGEO; Material Name: 贴片电阻0603 27Ω 5%; Product Code: WP0002702; Supplier: 南京南山半导体有限公司
R33 R49 = R 0603 1k: as R17 on sheet Power; Supplier: 南京南山半导体有限公司
R42 R44 = R 0603 10k: as R1 on sheet iF11M; Supplier: 南京南山半导体有限公司
R45 = R 0603 56k: 5%; Part No: W-T-RE-RS03K563JT; Manufacturer: LAGEO; Material Name: 贴片电阻0603 56K 5%; Product Code: WP0002712; Supplier: 南京南山半导体有限公司
U10 = ESP32-S3-WROOM-1
ZD1 = Zener Diode: Zener Diode 300mW

## Nets that join several sheets
AVDD: iF11M (C7.2 R2.1), microcontroller (J4.4)
BAT: iF11M (J2.12 J3.2 LD4.1 LD5.1), sensor (R15.2), Regulators (10 pins), Power (9 pins), microcontroller (R24.1)
DOVDD: iF11M (R2.2), Regulators (C23.2 C24.2 U6.5), microcontroller (J4.11 R42.2)
DVDD: Regulators (C26.2 C27.2 U7.5), microcontroller (J4.10)
GND: iF11M (26 pins), sensor (13 pins), Regulators (23 pins), Power (11 pins), Wireless Charging (11 pins), microcontroller (14 pins)
PVDD: iF11M (6 pins), Regulators (C29.1 C30.1 U8.5)
TFT3V3: Regulators (C20.2 C21.2 U5.5), microcontroller (J7.7 Q5.3 R45.2)
UC3V3: iF11M (5 pins), Regulators (C17.2 U4.5), microcontroller (U10.2)
VBUS: iF11M (7 pins), Wireless Charging (Q3.2 U13.1), microcontroller (R6.1)
VOUT: Power (C15.2 R3.1 U11.1), Wireless Charging (Q3.3 R35.2 U13.2 U13.16)
ADCTestPin: iF11M (U1.6), microcontroller (R33.1)
BOOT: iF11M (J6.4 R18.1 SW1.4 U3.5), microcontroller (U10.27)
CAMPDWN: iF11M (U1.15), microcontroller (J4.8 R44.1)
CEN: iF11M (U1.4), Regulators (R13.2 U6.3 U7.3)
CH: iF11M (J2.14), Power (U11.4)
DO: iF11M (R7.1), sensor (D2.2)
EN/RST: iF11M (J2.9 J6.5 R9.1), microcontroller (J7.6 U10.3)
FCH: iF11M (J2.13), Power (U11.3)
LEN: iF11M (U1.5), Regulators (R12.2 U5.3)
MBUSY: iF11M (U2.3), microcontroller (U10.31)
MUSIC: iF11M (U2.2), microcontroller (U10.16)
PEN: iF11M (U1.7), Regulators (R32.2 U8.3)
PWEN: iF11M (J2.11), Regulators (R14.2 U4.3)
RTC_SCL: iF11M (U3.7), microcontroller (U10.32)
RTC_SDA: iF11M (U3.6), microcontroller (U10.33)
RX: iF11M (J6.2), microcontroller (R31.2)
SENSOR: iF11M (Q6.3 R11.1), microcontroller (U10.39)
SER_CLK: iF11M (U1.11), microcontroller (U10.15)
SER_LAT: iF11M (U1.12), microcontroller (U10.22)
SER_SDI: iF11M (U1.14), microcontroller (U10.26)
TX: iF11M (J6.3), microcontroller (U10.36)

## Assembly variants
NoWireless: not fitted C49 C50 C51 C52 C68 D5 D6 D7 L3 L10 R35 R36 R39 U13